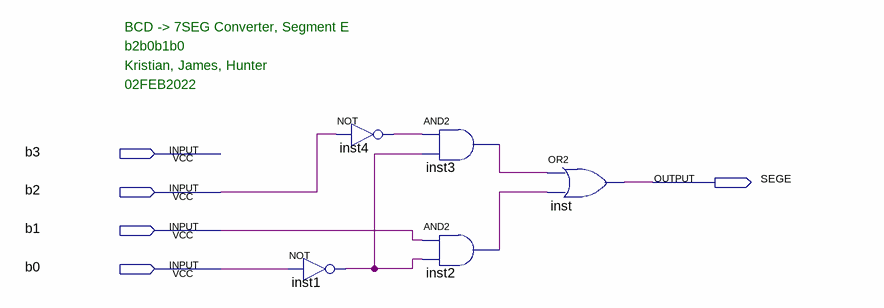
[diagram p0: schematic sheet]
// Quartus schematic BCD_7SEG_E.bdf as structural Verilog: 5 symbols, 5 pins
module BCD_7SEG_E (
  input  b3,
  input  b2,
  input  b1,
  input  b0,
  output SEGE
);

  wire inst1_out, inst2_out, inst3_out, inst4_out;

  not inst1 (inst1_out, b0);
  not inst4 (inst4_out, b2);
  and inst3 (inst3_out, inst4_out, inst1_out);
  and inst2 (inst2_out, b1, inst1_out);
  or inst (SEGE, inst3_out, inst2_out);

  // Notes on the sheet:
  //   BCD -> 7SEG Converter, Segment E
  //   b2b0b1b0
  //   Kristian, James, Hunter
  //   02FEB2022
endmodule
